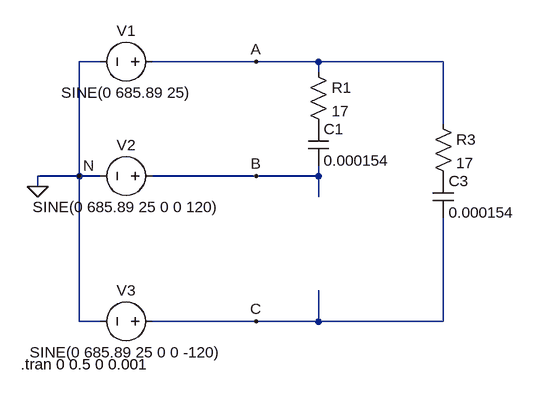
[diagram p0: schematic Draft2.asc]
Draft2.asc, the LTspice schematic file:
Version 4
SHEET 1 880 680
WIRE -16 64 -48 64
WIRE 224 64 64 64
WIRE 320 64 224 64
WIRE 512 64 320 64
WIRE 320 80 320 64
WIRE 512 160 512 64
WIRE -48 240 -48 64
WIRE -48 240 -112 240
WIRE -16 240 -48 240
WIRE 224 240 64 240
WIRE 320 240 320 224
WIRE 320 240 224 240
WIRE -112 256 -112 240
WIRE 320 272 320 240
WIRE -48 464 -48 240
WIRE -16 464 -48 464
WIRE 224 464 64 464
WIRE 320 464 320 416
WIRE 320 464 224 464
WIRE 512 464 512 304
WIRE 512 464 320 464
FLAG -112 256 0
FLAG -48 240 N
FLAG 224 64 A
FLAG 224 240 B
FLAG 224 464 C
SYMBOL voltage 80 64 R90
WINDOW 0 -32 56 VBottom 2
WINDOW 3 32 56 VTop 2
WINDOW 123 0 0 Left 0
WINDOW 39 0 0 Left 0
SYMATTR InstName V1
SYMATTR Value SINE(0 685.89 25)
SYMBOL voltage 80 240 R90
WINDOW 0 -32 56 VBottom 2
WINDOW 3 32 56 VTop 2
WINDOW 123 0 0 Left 0
WINDOW 39 0 0 Left 0
SYMATTR InstName V2
SYMATTR Value SINE(0 685.89 25 0 0 120)
SYMBOL voltage 80 464 R90
WINDOW 0 -32 56 VBottom 2
WINDOW 3 32 56 VTop 2
WINDOW 123 0 0 Left 0
WINDOW 39 0 0 Left 0
SYMATTR InstName V3
SYMATTR Value SINE(0 685.89 25 0 0 -120)
SYMBOL res 496 144 R0
SYMATTR InstName R3
SYMATTR Value 17
SYMBOL cap 496 240 R0
SYMATTR InstName C3
SYMATTR Value 0.000154
SYMBOL res 304 64 R0
SYMATTR InstName R1
SYMATTR Value 17
SYMBOL cap 304 160 R0
SYMATTR InstName C1
SYMATTR Value 0.000154
TEXT -138 530 Left 2 !.tran 0 0.5 0 0.001

The netlist it stands for:
* Draft2.asc
V1 A 0 SINE(0 685.89 25)
V2 B 0 SINE(0 685.89 25 0 0 120)
V3 C 0 SINE(0 685.89 25 0 0 -120)
R3 A P001 17
C3 P001 C 0.000154
R1 A P002 17
C1 P002 B 0.000154
.tran 0 0.5 0 0.001
.backanno
.end

* Results of the author's LTspice run, read from the files saved beside the schematic
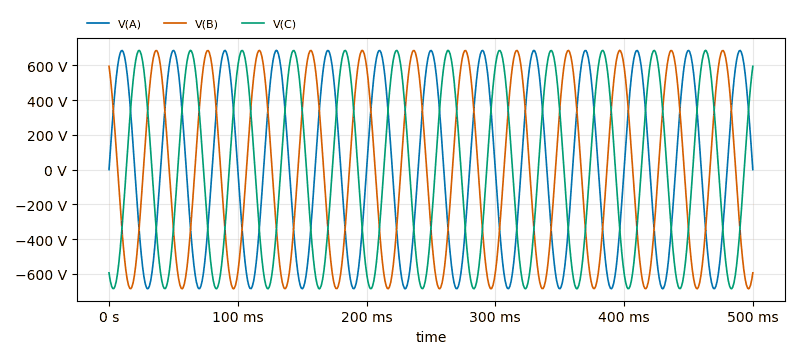
[diagram p1: Transient Analysis of Draft2.asc, plotted from the saved traces]
* Transient Analysis, 1 run:
*   V(A): min -685.9 V, max 685.9 V, average 17.43 V, rms 485 V, last 0 V
*   V(B): min -685.9 V, max 685.9 V, average -8.716 V, rms 485 V, last -594 V
*   V(C): min -685.9 V, max 685.9 V, average -8.717 V, rms 485 V, last 594 V